# EAGLE design dual_tdc (EAGLE 9.2.2)
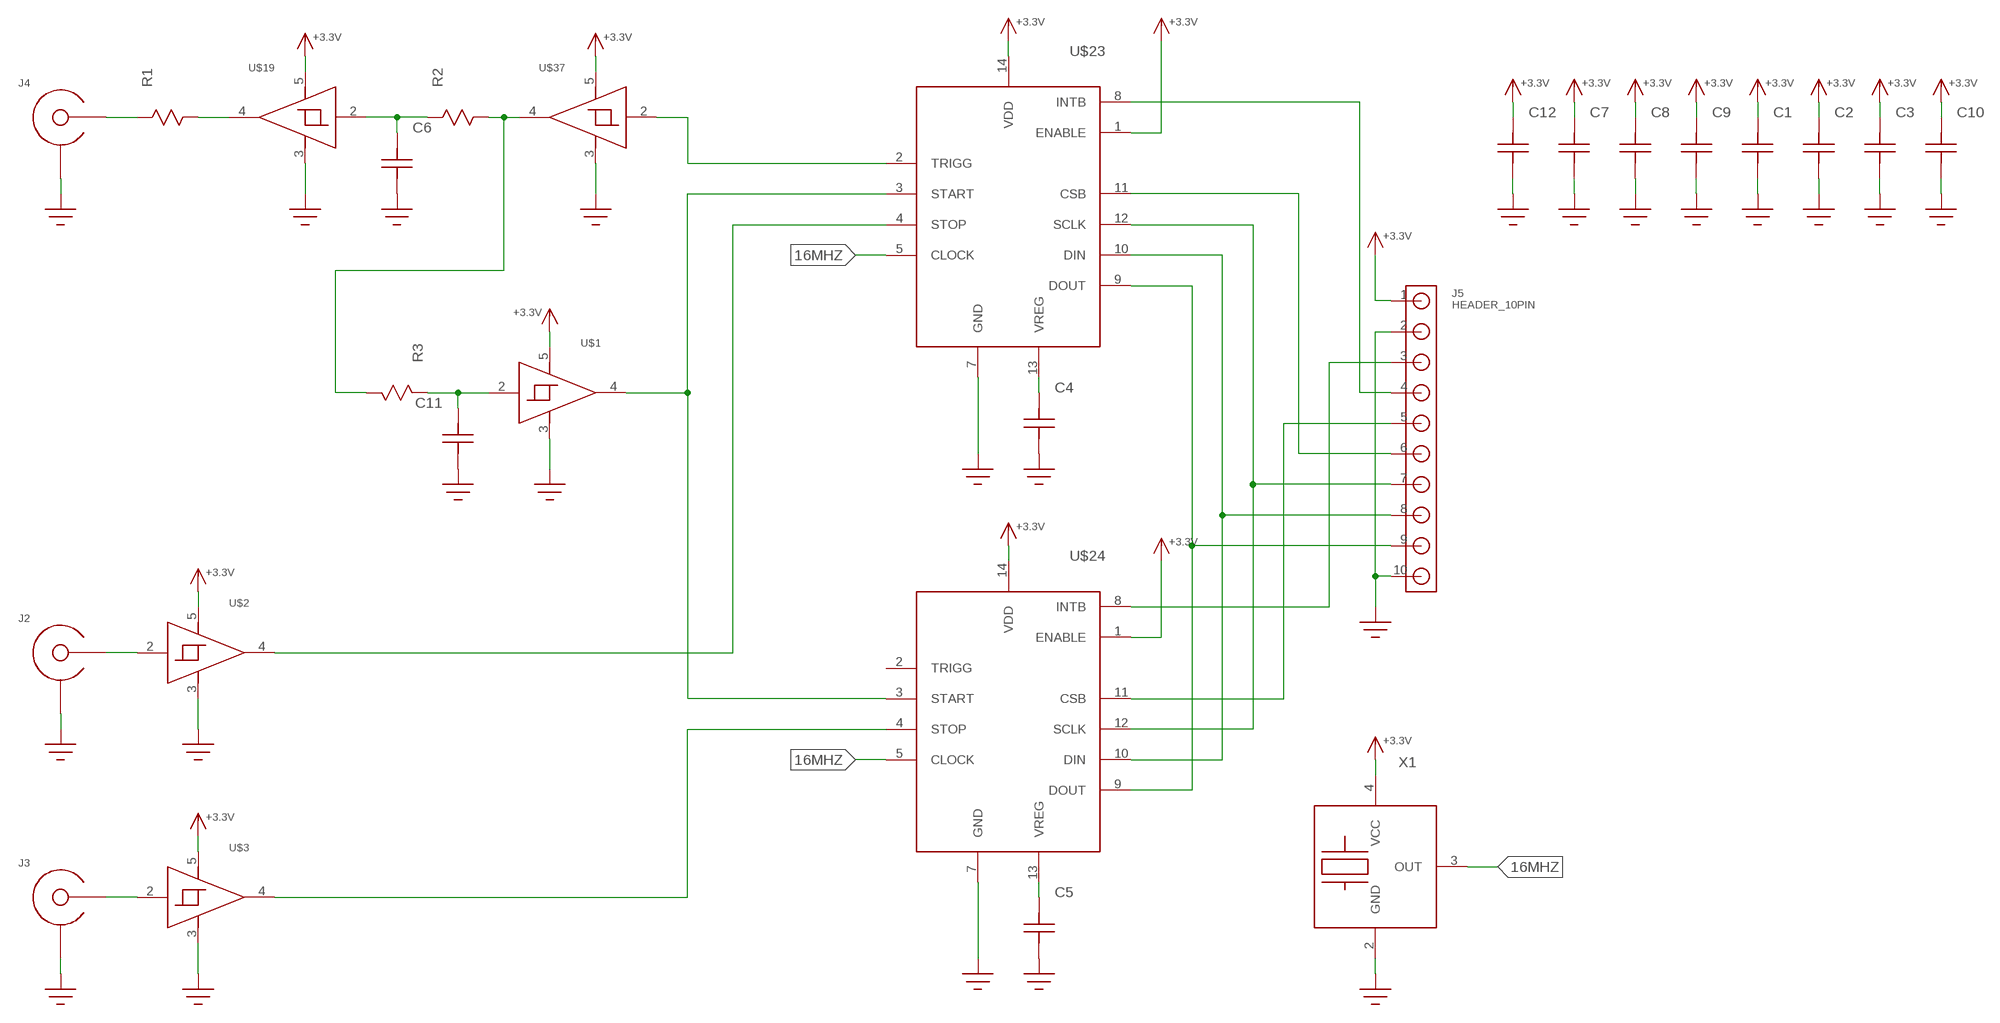
[diagram p0: schematic, sheet 1]

## Parts
C1  C0603  [C0603]
C2  C0603  [C0603]
C3  C0603  [C0603]
C4  C0805  [0805]
C5  C0805  [0805]
C6  C0603  [C0603]
C7  C0603  [C0603]
C8  C0603  [C0603]
C9  C0603  [C0603]
C10  C0603  [C0603]
C11  C0603  [C0603]
C12  C0603  [C0603]
J2  EDGE_LAUNCH_JACK  [EDGE_LAUNCH_RF_CON]
J3  EDGE_LAUNCH_JACK  [EDGE_LAUNCH_RF_CON]
J4  EDGE_LAUNCH_JACK  [EDGE_LAUNCH_RF_CON]
J5  HEADER_10PIN  [HEADER_10PIN]
R1  R0805  [R0805]
R2  R0603  [R0603]
R3  R0603  [R0603]
U$1  74LVC1G17  [SOT23-5]
U$2  74LVC1G17  [SOT23-5]
U$3  74LVC1G17  [SOT23-5]
U$19  74LVC1G17  [SOT23-5]
U$23  TDC7200TSSOP  [TSSOP14]
U$24  TDC7200TSSOP  [TSSOP14]
U$37  74LVC1G17  [SOT23-5]
X1  XTAL_OSC  [XTAL_3.2X5]

## Nets
16MHZ: U$23.5(CLOCK) U$24.5(CLOCK) X1.3(OUT)
+3.3V: C1.P$2 C2.P$2 C3.P$2 C7.P$2 C8.P$2 C9.P$2 C10.P$2 C12.P$2 J5.1 U$1.5(VCC) U$2.5(VCC) U$3.5(VCC) U$19.5(VCC) U$23.1(ENABLE) U$23.14(VDD) U$24.1(ENABLE) U$24.14(VDD) U$37.5(VCC) X1.4(VCC)
CH1: J2.CENTER U$2.2(IN)
CH2: J3.CENTER U$3.2(IN)
CSB2: J5.5 U$24.11(CSB)
DIN: J5.8 U$23.10(DIN) U$24.10(DIN)
DOUT: J5.9 U$23.9(DOUT) U$24.9(DOUT)
GND: C1.P$1 C2.P$1 C3.P$1 C4.P$1 C5.P$1 C6.P$1 C7.P$1 C8.P$1 C9.P$1 C10.P$1 C11.P$1 C12.P$1 J2.GND@1(SHIELD) J2.GND@2(SHIELD) J2.GND@3(SHIELD) J2.GND@4(SHIELD) J2.GND@5(SHIELD) J2.GND@6(SHIELD) J2.GND@7(SHIELD) J2.GND@8(SHIELD) J2.GND@9(SHIELD) J2.GND@10(SHIELD) J2.GND@11(SHIELD) J2.GND@12(SHIELD) J2.SHIELD@1(SHIELD) J2.SHIELD@2(SHIELD) J3.GND@1(SHIELD) J3.GND@2(SHIELD) J3.GND@3(SHIELD) J3.GND@4(SHIELD) J3.GND@5(SHIELD) J3.GND@6(SHIELD) J3.GND@7(SHIELD) J3.GND@8(SHIELD) J3.GND@9(SHIELD) J3.GND@10(SHIELD) J3.GND@11(SHIELD) J3.GND@12(SHIELD) J3.SHIELD@1(SHIELD) J3.SHIELD@2(SHIELD) J4.GND@1(SHIELD) J4.GND@2(SHIELD) J4.GND@3(SHIELD) J4.GND@4(SHIELD) J4.GND@5(SHIELD) J4.GND@6(SHIELD) J4.GND@7(SHIELD) J4.GND@8(SHIELD) J4.GND@9(SHIELD) J4.GND@10(SHIELD) J4.GND@11(SHIELD) J4.GND@12(SHIELD) J4.SHIELD@1(SHIELD) J4.SHIELD@2(SHIELD) J5.2 J5.10 U$1.3(GND) U$2.3(GND) U$3.3(GND) U$19.3(GND) U$23.7(GND) U$24.7(GND) U$37.3(GND) X1.2(GND)
INTB1: J5.4 U$23.8(INTB)
INTB2: J5.3 U$24.8(INTB)
N$1: U$23.2(TRIGG) U$37.2(IN)
N$2: J5.6 U$23.11(CSB)
N$4: J4.CENTER R1.P$1
N$5: R1.P$2 U$19.4(OUT)
N$6: C6.P$2 R2.P$1 U$19.2(IN)
N$7: C4.P$2 U$23.13(VREG)
N$8: C5.P$2 U$24.13(VREG)
N$9: U$1.4(OUT) U$23.3(START) U$24.3(START)
N$10: C11.P$2 R3.P$1 U$1.2(IN)
N$11: U$2.4(OUT) U$23.4(STOP)
N$12: U$3.4(OUT) U$24.4(STOP)
N$13: R2.P$2 R3.P$2 U$37.4(OUT)
SCLK: J5.7 U$23.12(SCLK) U$24.12(SCLK)
Unconnected: U$24.2(TRIGG)

## Library data of the parts
C1-C12 = yapo:C
J2-J4 = yapo:EDGE_LAUNCH_JACK
J5 = yapo:HEADER_10PIN
R1-R3 = yapo:R
U$1-U$3 U$19 U$37 = yapo:74LVC1G17
U$23 U$24 = yapo:TDC7200
X1 = yapo:XTAL_OSC

## Board
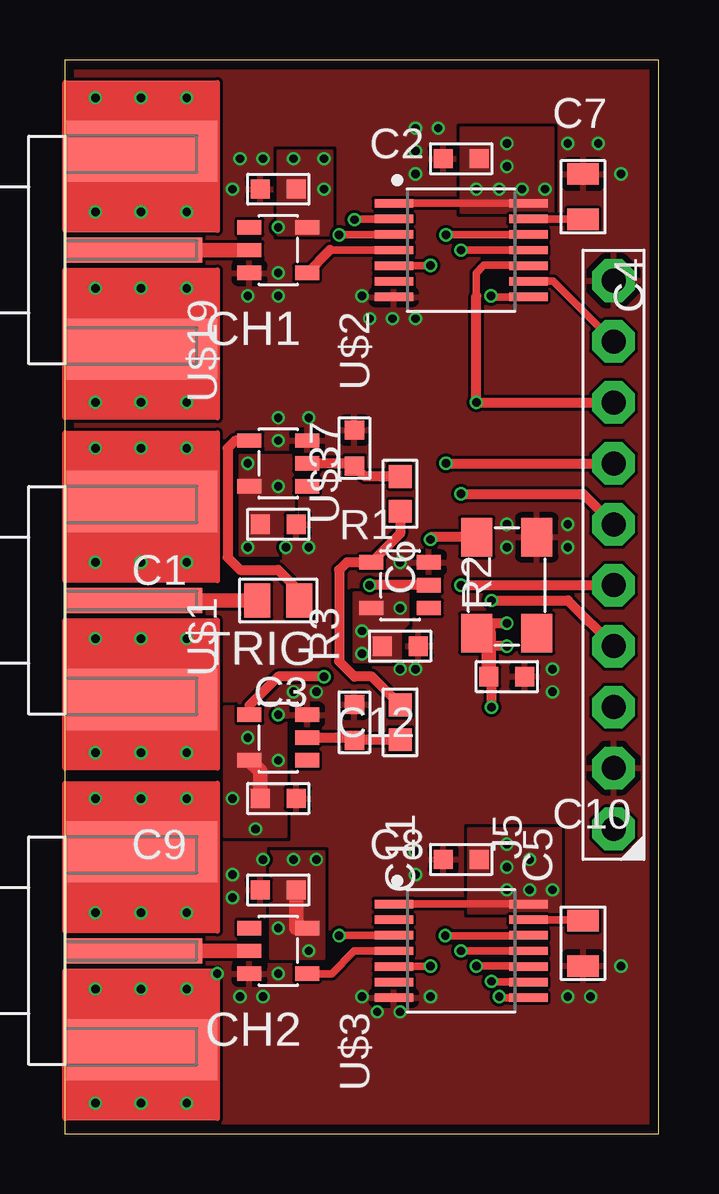
[diagram p1: board, top side]
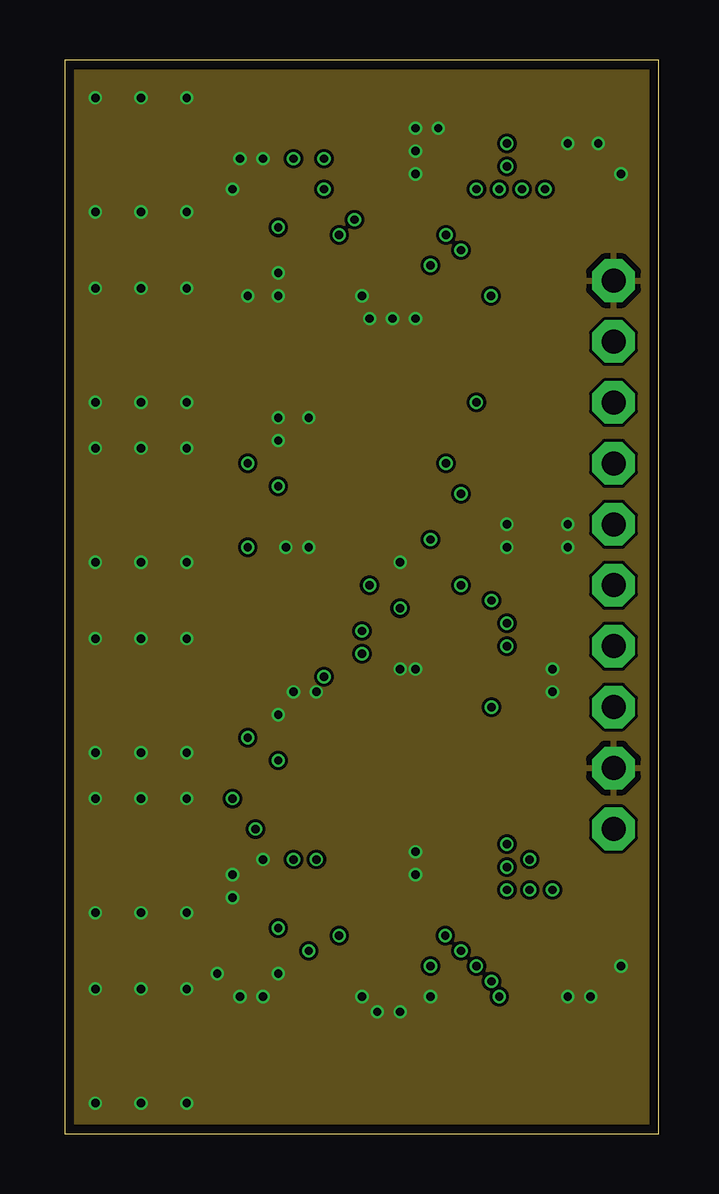
[diagram p2: board, inner layer Route2]
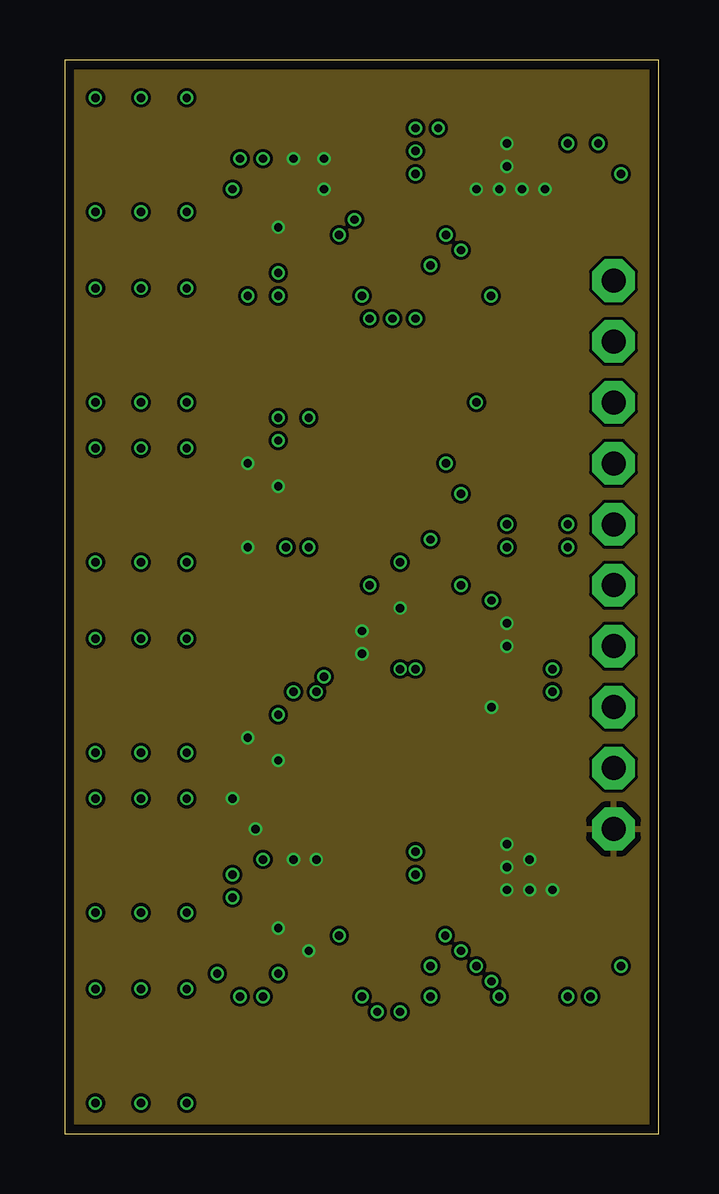
[diagram p3: board, inner layer Route15]
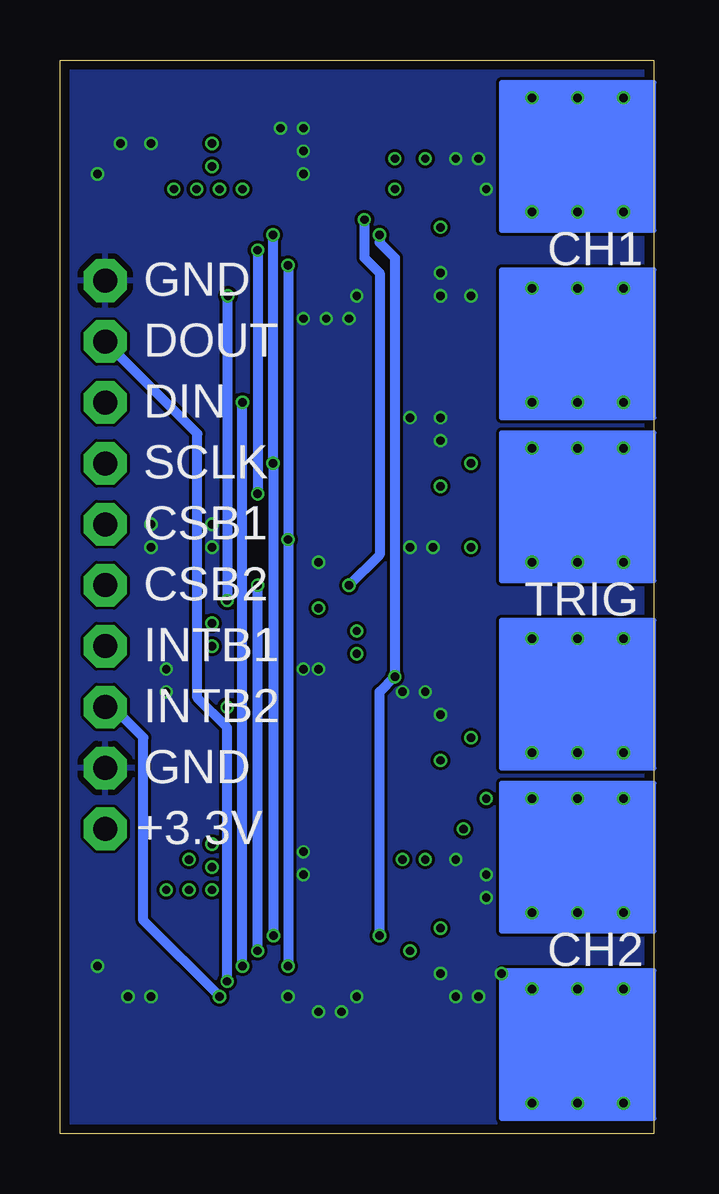
[diagram p4: board, bottom side, seen from below]

Size 24.75 x 44.76 mm. Coordinates in mm from the lower left corner, seen from the top.
Outline: 0,0 24.75,0 24.75,44.76 0,44.76 0,0
Copper layers (1*2*15*16): Top 0.035559375mm / dielectric 0.17018125mm / Route2 0.01778125mm / dielectric 47mil / Route15 0.01778125mm / dielectric 0.17018125mm / Bottom 0.035559375mm
Design rules "oshpark-4layer *": minimum track width 5mil, minimum drill 10mil, track to track 5mil, track to pad 5mil, pad to pad 5mil, via to via 5mil, smd to smd 5mil, copper to edge 15mil, drill to drill 6mil, minimum pad ring 4mil, minimum via ring 4mil, stop-mask expansion 2.5mil, vias tented up to drill 20mil, thermal gap 10mil

### Footprints (pad centres in the part's own frame; a part is rotated, then mirrored left to right if it is on the bottom)
C0603 = smd 0.8 x 0.8: P$1 -0.75,0; P$2 0.75,0
0805 = smd 0.9 x 1.3: P$1 -0.95,0; P$2 0.95,0
EDGE_LAUNCH_RF_CON = smd 5.715 x 1.041: CENTER -2.875,0 | drill 0.35: GND@1 -5.08,1.587; GND@2 -3.175,1.587; GND@3 -1.27,1.587; GND@4 -5.08,-1.587; GND@5 -3.175,-1.587; GND@6 -1.27,-1.587; GND@7 -5.08,6.35; GND@8 -3.175,6.35; GND@9 -1.27,6.35; GND@10 -5.08,-6.35; GND@11 -3.175,-6.35; GND@12 -1.27,-6.35 | smd 6.35 x 2.54: SHIELD@1 -3.175,-4.128; SHIELD@2 -3.175,4.128
HEADER_10PIN = drill 1 pad 1.778 octagon: 1 -11.43,0; 2 -8.89,0; 3 -6.35,0; 4 -3.81,0; 5 -1.27,0; 6 1.27,0; 7 3.81,0; 8 6.35,0; 9 8.89,0; 10 11.43,0
R0805 = smd 1.1 x 1.4: P$1 -0.875,0; P$2 0.875,0
R0603 = smd 0.95 x 0.95: P$1 -0.725,0; P$2 0.725,0
SOT23-5 = smd 0.6 x 1: 1 -0.95,-1.2; 2 0,-1.2; 3 0.95,-1.2; 4 0.95,1.2; 5 -0.95,1.2
TSSOP14 = smd 0.35 x 1.6: 1 -1.95,-2.8; 2 -1.3,-2.8; 3 -0.65,-2.8; 4 0,-2.8; 5 0.65,-2.8; 6 1.3,-2.8; 7 1.95,-2.8; 8 1.95,2.8; 9 1.3,2.8; 10 0.65,2.8; 11 0,2.8; 12 -0.65,2.8; 13 -1.3,2.8; 14 -1.95,2.8
XTAL_3.2X5 = smd 1.6 x 1.3: 1 -2,-1.25; 2 2,-1.25; 3 2,1.25; 4 -2,1.25

### Placement (x,y rotation side)
C1  8.89,25.4 180 top
C2  8.89,39.37 0 top
C3  13.97,20.32 180 top
C4  21.59,39.05 270 top
C5  21.59,7.94 90 top
C6  12.06,28.57 270 top
C7  16.51,40.64 0 top
C8  8.89,10.16 0 top
C9  8.89,13.97 180 top
C10  16.51,11.43 0 top
C11  12.06,17.14 270 top
C12  18.41,19.05 180 top
J2  0,36.83 180 top
J3  0,7.62 180 top
J4  0,22.23 180 top
J5  22.86,24.13 90 top
R1  8.89,22.23 0 top
R2  13.97,26.67 270 top
R3  13.97,17.14 90 top
U$1  8.89,16.51 90 top
U$2  8.89,36.83 270 top
U$3  8.89,7.62 270 top
U$19  8.89,27.94 90 top
U$23  16.51,36.83 270 top
U$24  16.51,7.62 270 top
U$37  13.97,22.86 90 top
X1  18.41,22.86 90 top

### Tracks (layer width: path | path; a pad name or v marks a point on that pad's centre or on a via)
16MHZ  (via drill 0.35)
  Top 0.305: v15.24,36.2 15.22,36.18 U$23.5 | U$24.5 15.22,6.97 v15.24,6.99
  Top 0.406: X1.3 15.24,24.86 v15.24,24.77
  Bottom 0.406: v15.24,36.2 v15.24,24.77 v15.24,6.99
+3.3V  (via drill 0.35)
  Top 0.305: U$23.1 U$23.14 | U$24.1 U$24.14
  Top 0.406: v18.41,21.27 17.88,21.27 17.46,20.86 | v18.41,20.32 17.66,20.32 | v17.78,17.78 17.78,18.93 C12.P$2
  Top 0.61: U$3.5 9.64,8.57 C8.P$2 | X1.4 17.46,20.86 17.66,20.86 17.66,20.32 C12.P$2 | C9.P$2 8.14,15.11 U$1.5
  other vias: 8.89,26.99 13.97,21.91 12.38,20 8.89,37.78 9.53,40.64 10.79,39.37 20,39.37 19.05,39.37 18.41,41.27 18.41,40.32 18.1,39.37 17.14,39.37 10.79,40.64 7.62,27.94 7.62,24.45 7.62,16.51 8.89,15.56 6.99,13.97 7.94,12.7 8.89,8.57 9.53,11.43 10.16,7.62 10.48,11.43 19.37,10.16 18.41,12.06 18.41,10.16 18.41,11.11 19.37,11.43 20.32,10.16 12.38,20.95
  pour Route15: 0,44.77 0,0 24.77,0 24.77,44.77
  pour Top (no thermals): 16.51,41.91 16.51,38.42 20.32,38.42 20.32,41.91
  pour Top (no thermals): 8.89,40.96 8.89,37.47 11.11,37.47 11.11,40.96
  pour Top (no thermals): 7.3,28.26 7.3,24.13 9.53,24.13 9.53,28.26
  pour Top (no thermals): 6.67,17.78 9.21,17.78 9.21,12.38 6.67,12.38
  pour Top (no thermals): 8.57,11.75 8.57,7.3 10.79,7.3 10.79,11.75
  pour Top (no thermals): 20.64,9.21 16.83,9.21 16.83,12.7 20.64,12.7
  pour Top (no thermals): 12.06,22.54 14.29,22.54 14.29,21.27 13.97,20.95 13.97,19.68 12.06,19.68
CH1
  Top 0.61: U$2.2 J2.CENTER
CH2
  Top 0.61: U$3.2 J3.CENTER
CSB2  (via drill 0.35)
  Top 0.305: v16.51,7.62 U$24.11
  Top 0.406: v16.51,22.86 J5.5
  Bottom 0.406: v16.51,7.62 v16.51,22.86
DIN  (via drill 0.35)
  Top 0.305: U$23.10 19.3,36.2 17.46,36.2 17.14,35.88 17.14,34.92 | v17.14,6.99 19.3,6.99 U$24.10
  Top 0.406: J5.8 v17.14,30.48 17.14,34.92
  Bottom 0.406: v17.14,6.99 v17.14,30.48
DOUT  (via drill 0.35)
  Top 0.305: U$23.9 20.35,35.53 J5.9 | U$24.9 17.81,6.32 v17.78,6.35
  Bottom 0.406: v17.78,6.35 17.78,16.92 19.02,18.16 19.02,29.18 J5.9
GND  (via drill 0.35)
  other vias: 10.16,29.84 10.16,24.45 7.62,34.92 8.26,40.64 14.61,40.96 13.65,33.97 12.7,33.97 9.21,24.45 8.89,28.89 13.97,19.37 14.61,19.37 13.97,23.81 20.32,19.37 20.32,18.41 18.41,25.4 18.41,24.45 20.95,25.4 20.95,24.45 8.89,35.88 7.3,40.64 6.99,39.37 8.89,34.92 8.89,29.84 8.89,17.46 9.53,18.41 10.48,18.41 8.89,6.67 7.3,5.71 8.26,5.71 8.26,11.43 6.99,10.79 6.99,9.84 14.61,11.75 14.61,10.79 23.18,6.99 21.91,5.71 20.95,5.71 15.56,41.91 14.61,41.91 20.95,41.27 22.23,41.27 23.18,40.01 12.38,34.92 14.61,33.97 12.38,5.71 13.02,5.08 13.97,5.08 15.24,5.71 6.35,6.67 14.61,40.01
  pour Route2: 0,44.45 24.77,44.45 24.77,0 0,0
  pour Top (rank 2): 0,44.45 24.77,44.45 24.77,0 0,0
  pour Bottom: 0,0 24.77,0 24.77,44.45 0,44.45
  pour Bottom: 0,0.32 24.77,0.32 24.77,44.77 0,44.77
  pour Bottom: 0.32,0.32 25.08,0.32 25.08,44.77 0.32,44.77
  pour Bottom: 0.32,0.32 25.08,0.32 25.08,44.77 0.32,44.77
  pour Bottom: 0,0.32 24.77,0.32 24.77,44.77 0,44.77
  pour Bottom: 0,0.32 24.77,0.32 24.77,44.77 0,44.77
  pour Bottom: 0,0.32 24.77,0.32 24.77,44.77 0,44.77
  pour Bottom: 0.32,0.32 25.08,0.32 25.08,44.77 0.32,44.77
  pour Bottom: 0,0.32 24.77,0.32 24.77,44.77 0,44.77
INTB1  (via drill 0.35)
  Top 0.305: v17.75,34.92 17.8,34.88 U$23.8
  Top 0.406: v17.78,22.23 20.95,22.23 J5.4
  Bottom 0.406: v17.75,34.92 17.78,34.9 v17.78,22.23
INTB2  (via drill 0.35)
  Top 0.305: U$24.8 18.14,5.67 v18.1,5.71
  Bottom 0.406: v18.1,5.71 21.27,8.89 21.27,16.51 22.54,17.78 J5.3
N$1  (via drill 0.35)
  Top 0.305: v12.06,38.1 12.1,38.13 U$23.2
  Top 0.406: U$37.2 v12.7,22.86
  Bottom 0.406: v12.06,38.1 12.06,36.51 11.43,35.88 11.43,24.13 v12.7,22.86
N$2  (via drill 0.35)
  Top 0.305: v16.51,36.83 U$23.11
  Top 0.406: v16.51,26.67 21.59,26.67 J5.6
  Bottom 0.406: v16.51,36.83 v16.51,26.67
N$4
  Top 0.61: J4.CENTER R1.P$1
N$5
  Top 0.406: U$19.4 7.1,28.89 6.78,28.57 6.78,24.02 7.3,23.5 8.89,23.5 9.77,22.62 R1.P$2
N$6
  Top 0.406: U$19.2 11.95,27.94 C6.P$2 12.49,27.39 R2.P$1
N$7
  Top 0.305: U$23.13 21.56,38.13 C4.P$2
N$8
  Top 0.305: U$24.13 21.56,8.92 C5.P$2
N$9  (via drill 0.35)
  Top 0.305: U$23.3 13.7,37.47 v11.43,37.47 | U$24.3 11.45,8.27 v11.43,8.26
  Top 0.406: v10.79,19.05 8.89,19.05 7.69,17.85 U$1.4
  Bottom 0.406: v11.43,37.47 11.43,37.15 10.79,36.51 v10.79,19.05 11.43,18.41 v11.43,8.26
N$10
  Top 0.406: U$1.2 11.95,16.51 C11.P$2 12.09,16.42 R3.P$1
N$11
  Top 0.305: 11.04,36.83 U$23.4
  Top 0.406: U$2.4 11.04,36.83
N$12
  Top 0.305: U$24.4 12.06,7.62 11.11,6.67 U$3.4
N$13
  Top 0.406: R2.P$2 13.97,25.01 U$37.4 11.74,23.81 11.43,23.5 11.43,19.68 12.06,19.05 12.79,19.05 R3.P$2
SCLK  (via drill 0.35)
  Top 0.305: v15.88,37.47 v15.89,37.48 U$23.12 | v15.85,8.26 19.3,8.26 U$24.12
  Top 0.406: v15.88,27.94 J5.7
  Bottom 0.406: v15.88,37.47 v15.88,27.94 15.85,27.91 v15.85,8.26

### Text on the board
tPlace: CH1 | TRIG | CH2
bPlace: CH1 | GND | DOUT | DIN | SCLK | CSB1 | TRIG | CSB2 | INTB1 | INTB2 | GND | +3.3V | CH2